# Altium project ComboCamera_OV2640.PrjPcb
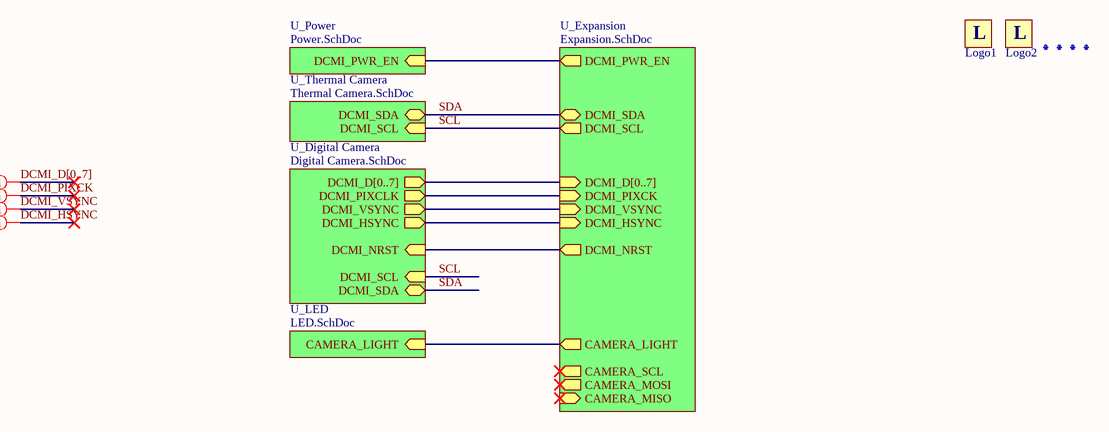
[diagram p0: ComboCamera_OV2640.SchDoc]
6 sheets, 63 parts. Net scope: hierarchical (ports join the sheet entries above them; power ports are global).
Board file: ComboCamera_OV2640.PcbDoc
Sheets:
  ComboCamera_OV2640.SchDoc
    U_Power = Power.SchDoc
    U_Digital Camera = Digital Camera.SchDoc
    U_Thermal Camera = Thermal Camera.SchDoc
    U_Expansion = Expansion.SchDoc
    U_LED = LED.SchDoc

## Sheet ComboCamera_OV2640.SchDoc: Combo Camera
size A4; Revision: 1; SheetNumber: 1; SheetTotal: 1; SheetSize: A4

### Parts
Fid1  Fiducial mark  [Fiducial]  (value not drawn)  (no BOM)
Fid2  Fiducial mark  [Fiducial]  (value not drawn)  (no BOM)
Fid3  Fiducial mark  [Fiducial]  (value not drawn)  (no BOM)
Fid4  Fiducial mark  [Fiducial]  (value not drawn)  (no BOM)
Logo1  Logo symbol  [LOGO_YILDIZIOT]  (value not drawn)  (no BOM)
Logo2  Logo symbol  [LOGO_YILDIZIOT]  (value not drawn)  (no BOM)

### Sub-sheets
U_Digital Camera = Digital Camera.SchDoc: DCMI_D[0..7] (out), DCMI_PIXCLK (out), DCMI_VSYNC (out), DCMI_HSYNC (out), DCMI_SCL (in), DCMI_SDA (bidir), DCMI_NRST (in)
U_Expansion = Expansion.SchDoc: DCMI_D[0..7] (in), DCMI_PWR_EN (out), DCMI_VSYNC (in), DCMI_HSYNC (in), DCMI_PIXCK (in), DCMI_SDA (bidir), DCMI_SCL (out), CAMERA_SCL (out), CAMERA_MISO (in), CAMERA_MOSI (out), CAMERA_LIGHT (out), DCMI_NRST (out)
U_LED = LED.SchDoc: CAMERA_LIGHT (in)
U_Power = Power.SchDoc: DCMI_PWR_EN (in)
U_Thermal Camera = Thermal Camera.SchDoc: DCMI_SDA (bidir), DCMI_SCL (in)

### Nets
CAMERA_LIGHT: sheet U_Expansion/CAMERA_LIGHT, sheet U_LED/CAMERA_LIGHT
DCMI_HSYNC: sheet U_Digital Camera/DCMI_HSYNC, sheet U_Expansion/DCMI_HSYNC
DCMI_NRST: sheet U_Digital Camera/DCMI_NRST, sheet U_Expansion/DCMI_NRST
DCMI_PIXCK: sheet U_Digital Camera/DCMI_PIXCLK, sheet U_Expansion/DCMI_PIXCK
DCMI_PWREN: sheet U_Power/DCMI_PWR_EN, sheet U_Expansion/DCMI_PWR_EN
DCMI_VSYNC: sheet U_Digital Camera/DCMI_VSYNC, sheet U_Expansion/DCMI_VSYNC
SCL: sheet U_Digital Camera/DCMI_SCL, sheet U_Thermal Camera/DCMI_SCL, sheet U_Expansion/DCMI_SCL  [project net DCMI_SCL]
SDA: sheet U_Digital Camera/DCMI_SDA, sheet U_Thermal Camera/DCMI_SDA, sheet U_Expansion/DCMI_SDA  [project net DCMI_SDA]

### Buses and harness runs
bus DCMI_D[0..7]
bus sheet U_Digital Camera/DCMI_D[0..7] = sheet U_Expansion/DCMI_D[0..7]

### Layout directives
rule Matched Net Lengths [Tolerance = 100mil]; net class DCMI: (no net found under the mark), DCMI_HSYNC, DCMI_PIXCK, DCMI_VSYNC

### Notes on the sheet
- Title:
- Size:
- Project:
- Revision:
- Sheet
- of
- Date:
- YıLDıZ IoT
- Elperek Mahallesi
- Saray Sokak, No:12
- SAKARYA / TURKEY
- File:
- (in symbol Logo) L

### Library data of the parts
Fid1-Fid4 = Fiducial: Part Number: Fid-Mark; Artikkelnr Noca: N.A.; Manufacturer: *; Manufacturer Part Number: *; Datasheet: *; LatestRevisionDate: 2009-12-12; Pin Count: 1; Publisher: Nordic Semiconductor; Published: 2009-12-12; Value: *; Note: *; Supplier: *; Supplier part number: *; 2nd source Supplier: *; 2nd source part number: *; Footprint Doc: Fiducial; Artikkelnr Simpro: N.A.
Logo1 Logo2 = Logo: Schematic symbol for Logo

## Sheet Power.SchDoc: POWER
size A4; SheetSize: A4
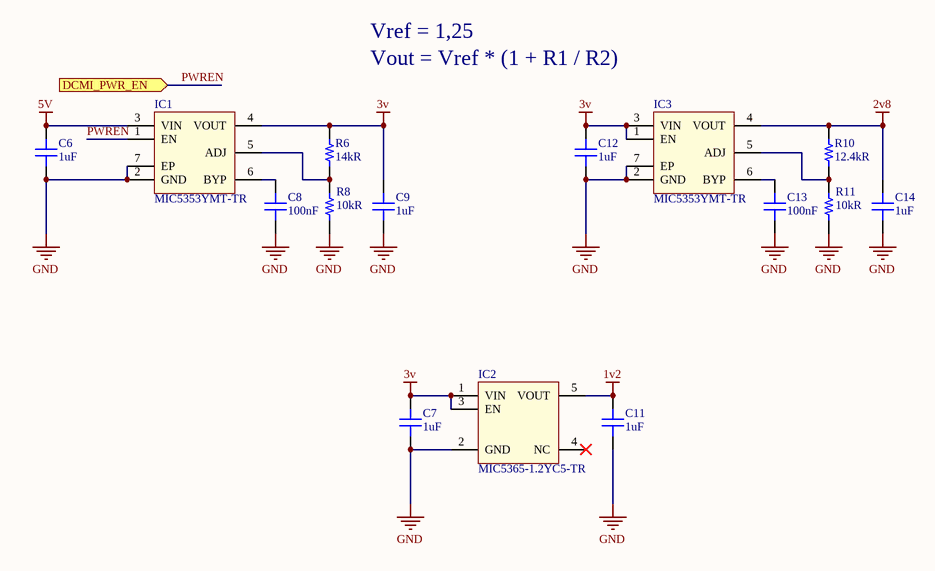
[diagram p1: Power.SchDoc]

### Parts
C6  1uF  [CAP 0603/1608]
C7  1uF  [CAP 0603/1608]
C8  100nF  [CAP 0603/1608]
C9  1uF  [CAP 0603/1608]
C11  1uF  [CAP 0603/1608]
C12  1uF  [CAP 0603/1608]
C13  100nF  [CAP 0603/1608]
C14  1uF  [CAP 0603/1608]
IC1  MIC5353YMT-TR  [MICREL MLF-6 1.6x1.6MM]
IC2  MIC5365-1.2YC5-TR  [MICROCHIP SC70-5 LT]
IC3  MIC5353YMT-TR  [MICREL MLF-6 1.6x1.6MM]
R6  14kR  [RES 0603/1608]
R8  10kR  [RES 0603/1608]
R10  12.4kR  [RES 0603/1608]
R11  10kR  [RES 0603/1608]

### Ports
DCMI_PWR_EN (in)

### Nets
1v2: C11.2 IC2.5(VOUT)
2v8: C14.2 IC3.4(VOUT) R10.2
3v: C7.2 C9.2 C12.2 IC1.4(VOUT) IC2.1(VIN) IC2.3(EN) IC3.1(EN) IC3.3(VIN) R6.2
5V: C6.2 IC1.3(VIN)
GND: C6.1 C7.1 C8.1 C9.1 C11.1 C12.1 C13.1 C14.1 IC1.2(GND) IC1.7(EP) IC2.2(GND) IC3.2(GND) IC3.7(EP) R8.2 R11.2
PWREN: IC1.1(EN) ; port DCMI_PWR_EN  [project net DCMI_PWREN]
NetC8_2: C8.2 IC1.6(BYP)
NetC13_2: C13.2 IC3.6(BYP)
NetIC1_5: IC1.5(ADJ) R6.1 R8.1
NetIC3_5: IC3.5(ADJ) R10.1 R11.1

Not connected (* = marked no-connect by the designer): IC2 4(NC)*

### Notes on the sheet
- Vout = Vref * (1 + R1 / R2)
- Vref = 1,25
- Title:
- Size:
- Project:
- Revision:
- Sheet
- of
- Date:
- YıLDıZ IoT
- Elperek Mahallesi
- Saray Sokak, No:12
- SAKARYA / TURKEY
- File:

### Library data of the parts
C6 C7 C9 C11 C12 C14 = Capacitor - Ceramic: Ceramic, SMT Capacitor; Manufacturer: Samsung; Manufacturer Part Number: CL10A105KP8NNNC; Tolerance: 10%; Voltage Rating: 10V; Dielectric: X5R; Supplier 1: Digi-Key; Supplier Part Number 1: 1276-1182-1-ND; Stock 1: 4590831; Pricing 1: 1 = 0,10000, 10 = 0,03800, 100 = 0,01680, 500 = 0,01200, 1000 = 0,00943 (USD); RoHS: Yes; Mount: Surface Mount; Case/Package: 0603; Case Code (Metric): 1608; Case Code (Imperial): 0603; Contact Plating: Tin; Min Operating Temperature: -55°C; Max Operating Temperature: 85°C; Packaging: Tape and Reel; Package Quantity: 1; Capacitance: 1uF; Voltage: 10V; Length: 1.6mm; Height: 0.8mm; Width: 0.031inch; Thickness: 0.035inch; Depth: 0.8mm; Radiation Hardening: No; ComponentLink1URL: https://datasheet.ciiva.com/15195/getdatasheetpartid-358616-15195708.pdf?src-supplier=Verical; ComponentLink1Description: https://datasheet.ciiva.com/15195/getdatasheetpartid-358616-15195708.pdf?src-supplier=Verical; ComponentLink2URL: https://datasheet.ciiva.com/16358/cl05b104kq5nnnc-16358431.pdf?src-supplier=Future+Electronics; ComponentLink2Description: https://datasheet.ciiva.com/16358/cl05b104kq5nnnc-16358431.pdf?src-supplier=Future+Electronics
C8 C13 = Capacitor - Ceramic: Ceramic, SMT Capacitor; Manufacturer: Samsung; Manufacturer Part Number: CL10B104JB8NNNC; Tolerance: 5%; Voltage Rating: 50V; Dielectric: X7R; Supplier 1: Digi-Key; Supplier Part Number 1: 1276-1033-1-ND; Stock 1: 223594; Pricing 1: 1 = 0,10000, 10 = 0,05300, 100 = 0,02350, 500 = 0,01680, 1000 = 0,01320 (USD); RoHS: Yes; Mount: Surface Mount; Case/Package: 0603; Case Code (Metric): 1608; Case Code (Imperial): 0603; Material: Ceramic; Contact Plating: Tin; Min Operating Temperature: -55°C; Max Operating Temperature: 125°C; Packaging: Tape and Reel; Package Quantity: 1; Capacitance: 100nF; Voltage: 50V; Length: 1.6mm; Height: 0.8mm; Width: 0.031inch; Thickness: 0.035inch; Depth: 0.8mm; Radiation Hardening: No; ComponentLink1URL: https://media.digikey.com/pdf/Data%20Sheets/Samsung%20PDFs/CL_Series_MLCC_ds.pdf?src-supplier=Digi-Key; ComponentLink1Description: https://media.digikey.com/pdf/Data%20Sheets/Samsung%20PDFs/CL_Series_MLCC_ds.pdf?src-supplier=Digi-Key; ComponentLink2URL: https://www.verical.com/server-webapp/html/getDatasheet?partID=359321&src-supplier=Verical; ComponentLink2Description: https://www.verical.com/server-webapp/html/getDatasheet?partID=359321&src-supplier=Verical; ComponentLink3URL: http://www1.futureelectronics.com/doc/SAMSUNG/CL10B104JB8NNNC.pdf?src-supplier=Future+Electronics; ComponentLink3Description: http://www1.futureelectronics.com/doc/SAMSUNG/CL10B104JB8NNNC.pdf?src-supplier=Future+Electronics; ComponentLink4URL: https://produktinfo.conrad.com/datenblaetter/450000-474999/456613-da-01-en-VS_KONDENSATOR_0603.pdf?src-supplier=Conrad; ComponentLink4Description: https://produktinfo.conrad.com/datenblaetter/450000-474999/456613-da-01-en-VS_KONDENSATOR_0603.pdf?src-supplier=Conrad
IC1 IC3 = MICROCHIP MIC5353: Integrated Circuit; ComponentLink1URL: http://www.farnell.com/datasheets/2245202.pdf?src-supplier=Farnell; ComponentLink1Description: http://www.farnell.com/datasheets/2245202.pdf?src-supplier=Farnell; ComponentLink2URL: http://www.microchip.com/mymicrochip/filehandler.aspx?ddocname=en579989&src-supplier=Digi-Key; ComponentLink2Description: http://www.microchip.com/mymicrochip/filehandler.aspx?ddocname=en579989&src-supplier=Digi-Key; ComponentLink3URL: http://www.farnell.com/datasheets/1692673.pdf?src-supplier=Element14; ComponentLink3Description: http://www.farnell.com/datasheets/1692673.pdf?src-supplier=Element14; Supplier 1: Digi-Key; Supplier Part Number 1: 576-3681-1-ND; Manufacturer: Microchip; Manufacturer Part Number: MIC5353YMT-TR; Stock 1: 1004; Pricing 1: 1 = 0,34000, 25 = 0,28000, 100 = 0,26000 (USD); RoHS: Yes; ComponentLink4URL: https://datasheet.ciiva.com/2049/mic5353-2049344.pdf?src-supplier=Digi-Key; ComponentLink4Description: https://datasheet.ciiva.com/2049/mic5353-2049344.pdf?src-supplier=Digi-Key; ComponentLink5URL: https://datasheet.ciiva.com/2049/mic5353-2049342.pdf?src-supplier=Digi-Key; ComponentLink5Description: https://datasheet.ciiva.com/2049/mic5353-2049342.pdf?src-supplier=Digi-Key; ComponentLink6URL: https://datasheet.ciiva.com/2049/mic5353-2049343.pdf?src-supplier=Digi-Key; ComponentLink6Description: https://datasheet.ciiva.com/2049/mic5353-2049343.pdf?src-supplier=Digi-Key
IC2 = MICROCHIP MIC5365/6-xxYC: High perfonmance 150mA LDO; Description: Linear Voltage Regulator IC Positive Fixed 1 Output 1.2V 150mA SC-70-5; Supplier 1: Digi-Key; Supplier Part Number 1: 576-3175-1-ND; Manufacturer: Microchip; Manufacturer Part Number: MIC5365-1.2YC5-TR; Stock 1: 6440; Pricing 1: 1 = 0,12000, 25 = 0,10000, 100 = 0,09000 (USD); RoHS: Yes; ComponentLink1URL: https://datasheet.ciiva.com/16461/mic5365-16461882.pdf?src-supplier=Future+Electronics; ComponentLink1Description: https://datasheet.ciiva.com/16461/mic5365-16461882.pdf?src-supplier=Future+Electronics
R6 = Resistor_Chip: Ceramic, SMT Capacitor; Manufacturer: Yageo; Manufacturer Part Number: RC0603FR-0714KL; Tolerance: 1%; Power Rating: 100mW; Voltage Rating: 75V; Temperature Coefficient: 100ppm/°C; Voltage Rating (DC): 50V; Supplier 1: Digi-Key; Supplier Part Number 1: 311-14.0KHRCT-ND; Stock 1: 622097; Pricing 1: 1 = 0,10000, 10 = 0,02300, 100 = 0,00940, 1000 = 0,00421, 2500 = 0,00366 (USD); RoHS: Yes; Case/Package: 0603; Weight: 7.1E-05oz; Case Code (Metric): 1608; Case Code (Imperial): 0603; Min Operating Temperature: -55°C; Max Operating Temperature: 155°C; Resistance: 14kR; Packaging: Tape and Reel; Package Quantity: 1; Max Power Dissipation: 100mW; Features: Moisture Resistant; Composition: Thick Film; Number of Terminations: 2; Termination: SMD/SMT; Military Standard: Not; Length: 1.6mm; Height: 0.022inch; Width: 0.031inch; Depth: 0.8mm; Lead Free: Lead Free; ComponentLink1URL: https://datasheet.ciiva.com/15189/getdatasheetpartid-325152-15189610.pdf?src-supplier=Verical; ComponentLink1Description: https://datasheet.ciiva.com/15189/getdatasheetpartid-325152-15189610.pdf?src-supplier=Verical; ComponentLink2URL: https://datasheet.ciiva.com/2455/pyu-r-int-thick-7-2455089.pdf?src-supplier=Digi-Key; ComponentLink2Description: https://datasheet.ciiva.com/2455/pyu-r-int-thick-7-2455089.pdf?src-supplier=Digi-Key; ComponentLink3URL: https://datasheet.ciiva.com/2455/pyu-r-int-thick-7-2455090.pdf?src-supplier=Digi-Key; ComponentLink3Description: https://datasheet.ciiva.com/2455/pyu-r-int-thick-7-2455090.pdf?src-supplier=Digi-Key; ComponentLink4URL: https://datasheet.ciiva.com/2455/pyu-r-int-thick-7-2455091.pdf?src-supplier=Digi-Key; ComponentLink4Description: https://datasheet.ciiva.com/2455/pyu-r-int-thick-7-2455091.pdf?src-supplier=Digi-Key
R8 R11 = Resistor_Chip: Ceramic, SMT Capacitor; Manufacturer: Stackpole Electronics; Manufacturer Part Number: RNCP0603FTD10K0; Tolerance: 1%; Max Power Dissipation: 125mW; Temperature Coefficient: 100ppm/°C; Supplier 1: Digi-Key; Supplier Part Number 1: RNCP0603FTD10K0CT-ND; Stock 1: 183083; Pricing 1: 1 = 0,10000, 10 = 0,06700, 100 = 0,02730, 1000 = 0,01224, 2500 = 0,01063 (USD); RoHS: Yes; Mount: Surface Mount; Case/Package: 0603; Case Code (Metric): 1608; Case Code (Imperial): 0603; Contact Plating: Matte,Tin; Min Operating Temperature: -55°C; Max Operating Temperature: 155°C; Packaging: Tape and Reel; Resistance: 10kR; Composition: Thin Film; Number of Terminations: 2; Features: Anti-Sulfur,Moisture Resistant; Length: 0.059inch; Height: 0.02inch; Width: 0.031inch; Radiation Hardening: No; Lead Free: Lead Free
R10 = Resistor_Chip: Ceramic, SMT Capacitor; Manufacturer: Yageo; Manufacturer Part Number: RC0603FR-0712K4L; Temperature Coefficient: 100ppm/°C; Tolerance: 1%; Voltage Rating (DC): 50V; Max Power Dissipation: 100mW; Working Voltage: 75V; ComponentLink1URL: https://datasheet.ciiva.com/15189/getdatasheetpartid-325152-15189610.pdf?src-supplier=Verical; ComponentLink1Description: https://datasheet.ciiva.com/15189/getdatasheetpartid-325152-15189610.pdf?src-supplier=Verical; ComponentLink2URL: https://datasheet.ciiva.com/2455/pyu-r-int-thick-7-2455089.pdf?src-supplier=Digi-Key; ComponentLink2Description: https://datasheet.ciiva.com/2455/pyu-r-int-thick-7-2455089.pdf?src-supplier=Digi-Key; ComponentLink3URL: https://datasheet.ciiva.com/2455/pyu-r-int-thick-7-2455090.pdf?src-supplier=Digi-Key; ComponentLink3Description: https://datasheet.ciiva.com/2455/pyu-r-int-thick-7-2455090.pdf?src-supplier=Digi-Key; ComponentLink4URL: https://datasheet.ciiva.com/2455/pyu-r-int-thick-7-2455091.pdf?src-supplier=Digi-Key; ComponentLink4Description: https://datasheet.ciiva.com/2455/pyu-r-int-thick-7-2455091.pdf?src-supplier=Digi-Key; ComponentLink5URL: https://datasheet.ciiva.com/2455/pyu-r-int-thick-7-2455035.pdf?src-supplier=Digi-Key; ComponentLink5Description: https://datasheet.ciiva.com/2455/pyu-r-int-thick-7-2455035.pdf?src-supplier=Digi-Key; ComponentLink6URL: https://datasheet.ciiva.com/2455/pyu-r-int-thick-7-2455036.pdf?src-supplier=Digi-Key; ComponentLink6Description: https://datasheet.ciiva.com/2455/pyu-r-int-thick-7-2455036.pdf?src-supplier=Digi-Key; ComponentLink7URL: https://datasheet.ciiva.com/2455/pyu-r-int-thick-7-2455037.pdf?src-supplier=Digi-Key; ComponentLink7Description: https://datasheet.ciiva.com/2455/pyu-r-int-thick-7-2455037.pdf?src-supplier=Digi-Key; ComponentLink8URL: https://datasheet.ciiva.com/15189/getdatasheetpartid-406810-15189757.pdf?src-supplier=Verical; ComponentLink8Description: https://datasheet.ciiva.com/15189/getdatasheetpartid-406810-15189757.pdf?src-supplier=Verical; Supplier 1: Digi-Key; Supplier Part Number 1: 311-12.4KHRCT-ND; Stock 1: 851439; Pricing 1: 1 = 0,10000, 10 = 0,02300, 100 = 0,00940, 1000 = 0,00421, 2500 = 0,00366 (USD); RoHS: Yes; Case/Package: 0603; Case Code (Metric): 1608; Case Code (Imperial): 0603; Min Operating Temperature: -55°C; Max Operating Temperature: 155°C; Composition: Thick Film; Packaging: Tape and Reel; Resistance: 12.4kR; Features: Moisture Resistant; Number of Terminations: 2; Termination: SMD/SMT; Military Standard: Not; Package Quantity: 1; Power Rating: 100mW; Voltage Rating: 50V; Length: 0.063inch; Height: 0.022inch; Width: 0.031inch; Depth: 0.8mm; Lead Free: Lead Free; ComponentLink9URL: https://datasheet.ciiva.com/2454/pyu-r-int-thick-7-2454069.pdf?src-supplier=Digi-Key; ComponentLink9Description: https://datasheet.ciiva.com/2454/pyu-r-int-thick-7-2454069.pdf?src-supplier=Digi-Key; ComponentLink10URL: https://datasheet.ciiva.com/2454/pyu-r-int-thick-7-2454070.pdf?src-supplier=Digi-Key; ComponentLink10Description: https://datasheet.ciiva.com/2454/pyu-r-int-thick-7-2454070.pdf?src-supplier=Digi-Key; ComponentLink11URL: https://datasheet.ciiva.com/2454/pyu-r-int-thick-7-2454071.pdf?src-supplier=Digi-Key; ComponentLink11Description: https://datasheet.ciiva.com/2454/pyu-r-int-thick-7-2454071.pdf?src-supplier=Digi-Key

## Sheet Digital Camera.SchDoc
size A4; SheetSize: A4 P
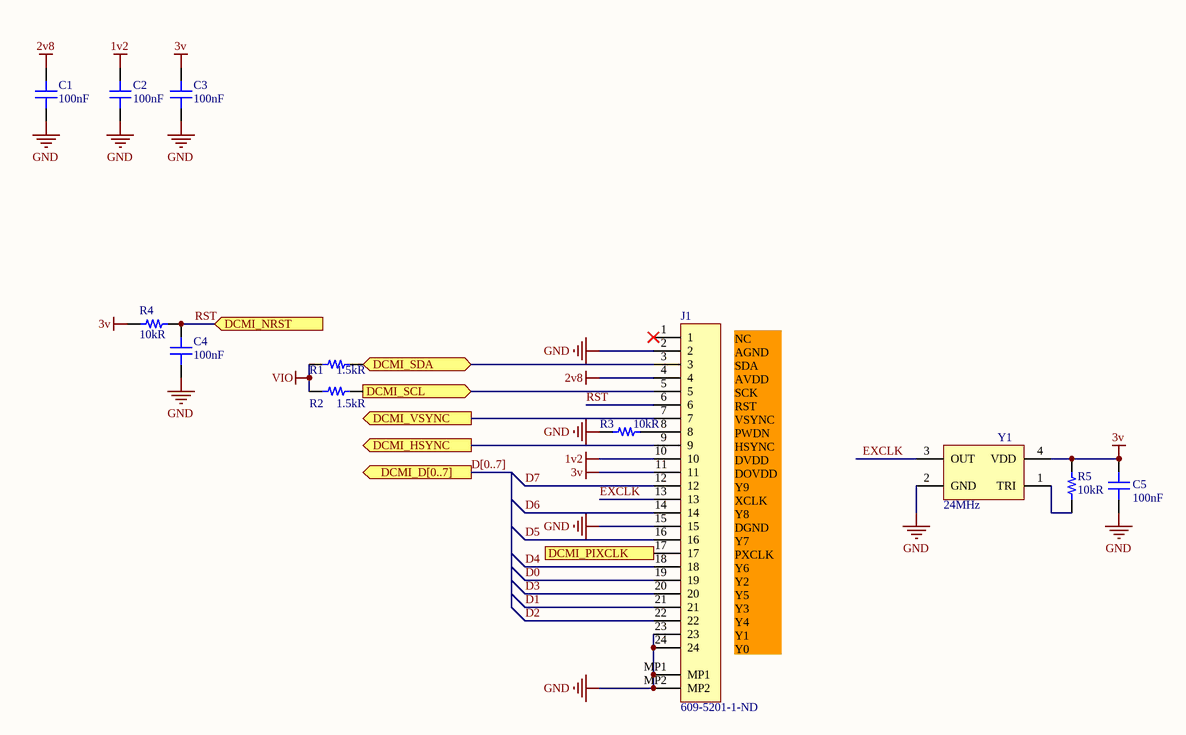
[diagram p2: Digital Camera.SchDoc]

### Parts
C1  100nF  [CAP 0603/1608]
C2  100nF  [CAP 0603/1608]
C3  100nF  [CAP 0603/1608]
C4  100nF  [CAP 0603/1608]
C5  100nF  [CAP 0603/1608]
J1  Supplier Part Number 1: 609-5201-1-ND  [Amphenol SFV24R-1STE1HLF]  (hidden comment: SFV24R-3STBE1HLF)
R1  1.5kR  [RES 0603/1608]
R2  1.5kR  [RES 0603/1608]
R3  10kR  [RES 0603/1608]
R4  10kR  [RES 0603/1608]
R5  10kR  [RES 0603/1608]
Y1  24MHz  [Abracon ASTX-11]

### Ports
DCMI_D[0..7] (out), DCMI_HSYNC (out), DCMI_NRST (in), DCMI_PIXCLK (out), DCMI_SCL (in), DCMI_SDA (bidir), DCMI_VSYNC (out)

### Nets
1v2: C2.2 J1.10
2v8: C1.2 J1.4
3v: C3.2 C5.2 J1.11 R4.2 R5.1 Y1.4(VDD)
GND: C1.1 C2.1 C3.1 C4.1 C5.1 J1.2 J1.15 J1.23 J1.24 J1.MP1 J1.MP2 R3.1 Y1.2(GND)
VIO: R1.2 R2.2
D0: J1.19
D1: J1.21
D2: J1.22
D3: J1.20
D4: J1.18
D5: J1.16
D6: J1.14
D7: J1.12
DCMI_HSYNC: J1.9 ; port DCMI_HSYNC
DCMI_PIXCK: J1.17 ; port DCMI_PIXCLK
DCMI_SCL: J1.5 R2.1 ; port DCMI_SCL
DCMI_SDA: J1.3 R1.1 ; port DCMI_SDA
DCMI_VSYNC: J1.7 ; port DCMI_VSYNC
EXCLK: J1.13 Y1.3(OUT)
RST: C4.2 J1.6 R4.1 ; port DCMI_NRST  [project net DCMI_NRST]
NetJ1_8: J1.8 R3.2
NetR5_2: R5.2 Y1.1(TRI)

Not connected (* = marked no-connect by the designer): J1 1*

### Buses and harness runs
bus D[0..7] = port DCMI_D[0..7]

### Notes on the sheet
- NC
  AGND
  SDA
  AVDD
  SCK
  RST
  VSYNC
  PWDN
  HSYNC
  DVDD
  DOVDD
  Y9
  XCLK
  Y8
  DGND
  Y7
  PXCLK
  Y6
  Y2
  Y5
  Y3
  Y4
  Y1
  Y0
- Title:
- Size:
- Project:
- Revision:
- Sheet
- of
- Date:
- YıLDıZ IoT
- Elperek Mahallesi
- Saray Sokak, No:12
- SAKARYA / TURKEY
- File:

### Library data of the parts
C1-C5 = Capacitor - Ceramic: as C8 on sheet Power; Supplier 1: Digi-Key; Supplier Part Number 1: 1276-1033-1-ND; Stock 1: 223594; Pricing 1: 1 = 0,10000, 10 = 0,05300, 100 = 0,02350, 500 = 0,01680, 1000 = 0,01320 (USD); RoHS: Yes; Mount: Surface Mount; Case/Package: 0603; Case Code (Metric): 1608; Case Code (Imperial): 0603; Material: Ceramic; Contact Plating: Tin; Min Operating Temperature: -55°C; Max Operating Temperature: 125°C; Packaging: Tape and Reel; Package Quantity: 1; Capacitance: 100nF; Voltage: 50V; Length: 1.6mm; Height: 0.8mm; Width: 0.031inch; Thickness: 0.035inch; Depth: 0.8mm; Radiation Hardening: No; ComponentLink1URL: https://media.digikey.com/pdf/Data%20Sheets/Samsung%20PDFs/CL_Series_MLCC_ds.pdf?src-supplier=Digi-Key; ComponentLink1Description: https://media.digikey.com/pdf/Data%20Sheets/Samsung%20PDFs/CL_Series_MLCC_ds.pdf?src-supplier=Digi-Key; ComponentLink2URL: https://www.verical.com/server-webapp/html/getDatasheet?partID=359321&src-supplier=Verical; ComponentLink2Description: https://www.verical.com/server-webapp/html/getDatasheet?partID=359321&src-supplier=Verical; ComponentLink3URL: http://www1.futureelectronics.com/doc/SAMSUNG/CL10B104JB8NNNC.pdf?src-supplier=Future+Electronics; ComponentLink3Description: http://www1.futureelectronics.com/doc/SAMSUNG/CL10B104JB8NNNC.pdf?src-supplier=Future+Electronics; ComponentLink4URL: https://produktinfo.conrad.com/datenblaetter/450000-474999/456613-da-01-en-VS_KONDENSATOR_0603.pdf?src-supplier=Conrad; ComponentLink4Description: https://produktinfo.conrad.com/datenblaetter/450000-474999/456613-da-01-en-VS_KONDENSATOR_0603.pdf?src-supplier=Conrad
J1 = FPC-24: Connector; Manufacturer: Amphenol FCI; Actuator Material: Glass,Polyphenylene; Voltage Rating: 50V; Current Rating: 500mA; Number of Positions: 24; Contact Location: Bottom; Insulation Resistance: 100MR; Pitch: 0.02inch; ComponentLink1URL: http://portal.fciconnect.com/Comergent//fci/drawing/10116954.pdf?src-supplier=Digi-Key; ComponentLink1Description: http://portal.fciconnect.com/Comergent//fci/drawing/10116954.pdf?src-supplier=Digi-Key; ComponentLink2URL: https://cdn.amphenol-icc.com/media/wysiwyg/files/drawing/10116954.pdf?src-supplier=Digi-Key; ComponentLink2Description: https://cdn.amphenol-icc.com/media/wysiwyg/files/drawing/10116954.pdf?src-supplier=Digi-Key; Supplier 1: Digi-Key; Manufacturer Part Number: SFV24R-3STBE1HLF; Stock 1: 4525; Pricing 1: 1 = 0,51000, 10 = 0,48200, 25 = 0,43400, 50 = 0,38580, 100 = 0,36960, 250 = 0,33748, 500 = 0,32142, 1000 = 0,26517 (USD); RoHS: Yes; Mount: Surface Mount; Contact Material: Bronze; Contact Plating: Gold; Housing Material: Polymer; Min Operating Temperature: -55°C; Max Operating Temperature: 105°C; Package Quantity: 6000; Packaging: Tape and Reel; Termination: Solder; Flammability Rating: UL94 V-0
R1 R2 = Resistor_Chip: Ceramic, SMT Capacitor; Manufacturer: Yageo; Manufacturer Part Number: RC0603FR-071K5L; Tolerance: 1%; Voltage Rating (DC): 50V; Temperature Coefficient: 100ppm/°C; Power Rating: 100mW; Supplier 1: Digi-Key; Supplier Part Number 1: 311-1.50KHRCT-ND; Stock 1: 4073514; Pricing 1: 1 = 0,10000, 10 = 0,02300, 100 = 0,00940, 1000 = 0,00421, 2500 = 0,00366 (USD); RoHS: Yes; Case/Package: 0603; Number of Pins: 2; Case Code (Metric): 1608; Case Code (Imperial): 0603; Min Operating Temperature: -55°C; Max Operating Temperature: 155°C; Packaging: Tape and Reel; Resistance: 1.5kR; Composition: Thick Film; Voltage Rating: 50V; Number of Terminations: 2; Termination: SMD/SMT; Military Standard: Not; Package Quantity: 1; Features: Moisture Resistant; Max Power Dissipation: 100mW; Length: 0.063inch; Height: 0.022inch; Width: 0.031inch; Depth: 0.8mm; REACH SVHC: No SVHC; Lead Free: Lead Free; ComponentLink1URL: https://datasheet.ciiva.com/2454/pyu-r-int-thick-7-2454513.pdf?src-supplier=Digi-Key; ComponentLink1Description: https://datasheet.ciiva.com/2454/pyu-r-int-thick-7-2454513.pdf?src-supplier=Digi-Key; ComponentLink2URL: https://datasheet.ciiva.com/2454/pyu-r-int-thick-7-2454514.pdf?src-supplier=Digi-Key; ComponentLink2Description: https://datasheet.ciiva.com/2454/pyu-r-int-thick-7-2454514.pdf?src-supplier=Digi-Key; ComponentLink3URL: https://datasheet.ciiva.com/2454/pyu-r-int-thick-7-2454515.pdf?src-supplier=Digi-Key; ComponentLink3Description: https://datasheet.ciiva.com/2454/pyu-r-int-thick-7-2454515.pdf?src-supplier=Digi-Key; ComponentLink4URL: https://datasheet.ciiva.com/46440/1868787-46440895.pdf?src-supplier=Element14; ComponentLink4Description: https://datasheet.ciiva.com/46440/1868787-46440895.pdf?src-supplier=Element14
R3-R5 = Resistor_Chip: as R8 on sheet Power; Supplier 1: Digi-Key; Supplier Part Number 1: RNCP0603FTD10K0CT-ND; Stock 1: 183083; Pricing 1: 1 = 0,10000, 10 = 0,06700, 100 = 0,02730, 1000 = 0,01224, 2500 = 0,01063 (USD); RoHS: Yes; Mount: Surface Mount; Case/Package: 0603; Case Code (Metric): 1608; Case Code (Imperial): 0603; Contact Plating: Matte,Tin; Min Operating Temperature: -55°C; Max Operating Temperature: 155°C; Packaging: Tape and Reel; Resistance: 10kR; Composition: Thin Film; Number of Terminations: 2; Features: Anti-Sulfur,Moisture Resistant; Length: 0.059inch; Height: 0.02inch; Width: 0.031inch; Radiation Hardening: No; Lead Free: Lead Free
Y1 = ASD1-1.544MHZ-EC-T: OSC XO 1.544MHZ CMOS SMD; Manufacturer: ECS Inc.; Manufacturer Part Number: ECS-3225MV-240-CN-TR; Base Resonator: Crystal; Function: Enable/Disable; Output: HCMOS; Voltage - Supply: 1.62V ~ 3.63V; Frequency Stability: ±25ppm; ComponentLink1Description: Datasheet; ComponentLink1URL: http://www.abracon.com/Oscillators/ASDseries.pdf; ComponentLink2Description: Digi-Key Listing; ComponentLink2URL: https://www.digikey.com/product-detail/en/ASD1-1.544MHZ-EC-T/535-9579-2-ND/1236896; Supplier 1: Digi-Key; Supplier Part Number 1: XC2884CT-ND; Stock 1: 1655; Pricing 1: 1 = 0,92000, 10 = 0,81700, 50 = 0,76380, 100 = 0,67510, 500 = 0,63954 (USD); RoHS: No; ComponentLink3URL: https://www.ecsxtal.com/store/pdf/ECS-3225MV.pdf?src-supplier=Digi-Key; ComponentLink3Description: https://www.ecsxtal.com/store/pdf/ECS-3225MV.pdf?src-supplier=Digi-Key; Packaging: Cut Tape (CT); Type: XO (Standard); Frequency: 24MHz; Series: ECS-3225MV

## Sheet Thermal Camera.SchDoc: Thermal
size A4; SheetSize: A4
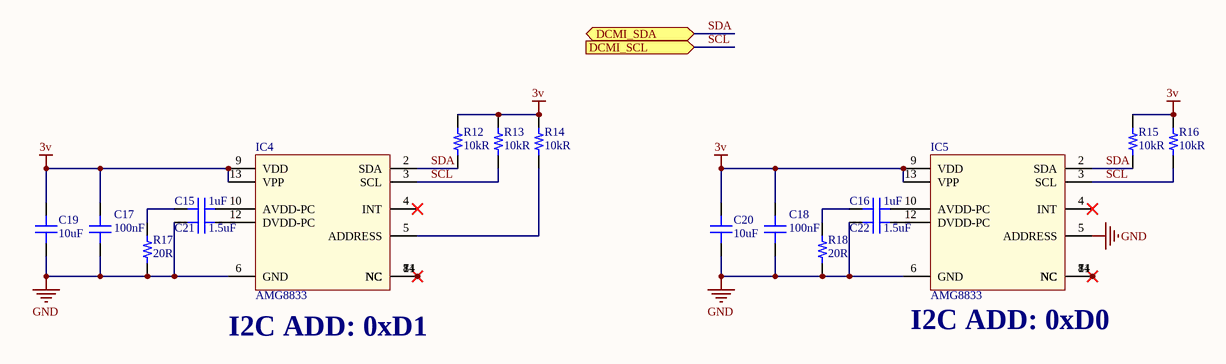
[diagram p3: Thermal Camera.SchDoc]

### Parts
C15  1uF  [CAP 0603/1608]
C16  1uF  [CAP 0603/1608]
C17  100nF  [CAP 0603/1608]
C18  100nF  [CAP 0603/1608]
C19  10uF  [CAP 0603/1608]
C20  10uF  [CAP 0603/1608]
C21  1.5uF  [CAP 0603/1608]
C22  1.5uF  [CAP 0603/1608]
IC4  AMG8833  [PANASONIC AMG8853]
IC5  AMG8833  [PANASONIC AMG8853]
R12  10kR  [RES 0603/1608]
R13  10kR  [RES 0603/1608]
R14  10kR  [RES 0603/1608]
R15  10kR  [RES 0603/1608]
R16  10kR  [RES 0603/1608]
R17  20R  [RES 0603/1608]
R18  20R  [RES 0603/1608]

### Ports
DCMI_SCL (in), DCMI_SDA (bidir)

### Nets
3v: C17.1 C18.1 C19.2 C20.2 IC4.9(VDD) IC4.13(VPP) IC5.9(VDD) IC5.13(VPP) R12.2 R13.2 R14.2 R15.2 R16.2
GND: C17.2 C18.2 C19.1 C20.1 C21.2 C22.2 IC4.6(GND) IC5.5(ADDRESS) IC5.6(GND) R17.1 R18.1
SCL: IC4.3(SCL) IC5.3(SCL) R13.1 R16.1 ; port DCMI_SCL  [project net DCMI_SCL]
SDA: IC4.2(SDA) IC5.2(SDA) R12.1 R15.1 ; port DCMI_SDA  [project net DCMI_SDA]
NetC15_1: C15.1 R17.2
NetC15_2: C15.2 IC4.10(AVDD-PC)
NetC16_1: C16.1 R18.2
NetC16_2: C16.2 IC5.10(AVDD-PC)
NetC21_1: C21.1 IC4.12(DVDD-PC)
NetC22_1: C22.1 IC5.12(DVDD-PC)
NetIC4_1: IC4.1(NC) IC4.7(NC) IC4.8(NC) IC4.11(NC) IC4.14(NC)
NetIC4_5: IC4.5(ADDRESS) R14.1
NetIC5_1: IC5.1(NC) IC5.7(NC) IC5.8(NC) IC5.11(NC) IC5.14(NC)

Not connected (* = marked no-connect by the designer): IC4 4(INT)*; IC5 4(INT)*

### Notes on the sheet
- (near IC4) I2C ADD: 0xD1
- (near IC5) I2C ADD: 0xD0
- Title:
- Size:
- Project:
- Revision:
- Sheet
- of
- Date:
- YıLDıZ IoT
- Elperek Mahallesi
- Saray Sokak, No:12
- SAKARYA / TURKEY
- File:

### Library data of the parts
C15 C16 = Capacitor - Ceramic: as C6 on sheet Power; Supplier 1: Digi-Key; Supplier Part Number 1: 1276-1182-1-ND; Stock 1: 4590831; Pricing 1: 1 = 0,10000, 10 = 0,03800, 100 = 0,01680, 500 = 0,01200, 1000 = 0,00943 (USD); RoHS: Yes; Mount: Surface Mount; Case/Package: 0603; Case Code (Metric): 1608; Case Code (Imperial): 0603; Contact Plating: Tin; Min Operating Temperature: -55°C; Max Operating Temperature: 85°C; Packaging: Tape and Reel; Package Quantity: 1; Capacitance: 1uF; Voltage: 10V; Length: 1.6mm; Height: 0.8mm; Width: 0.031inch; Thickness: 0.035inch; Depth: 0.8mm; Radiation Hardening: No; ComponentLink1URL: https://datasheet.ciiva.com/15195/getdatasheetpartid-358616-15195708.pdf?src-supplier=Verical; ComponentLink1Description: https://datasheet.ciiva.com/15195/getdatasheetpartid-358616-15195708.pdf?src-supplier=Verical; ComponentLink2URL: https://datasheet.ciiva.com/16358/cl05b104kq5nnnc-16358431.pdf?src-supplier=Future+Electronics; ComponentLink2Description: https://datasheet.ciiva.com/16358/cl05b104kq5nnnc-16358431.pdf?src-supplier=Future+Electronics
C17 C18 = Capacitor - Ceramic: as C8 on sheet Power; Supplier 1: Digi-Key; Supplier Part Number 1: 1276-1033-1-ND; Stock 1: 223594; Pricing 1: 1 = 0,10000, 10 = 0,05300, 100 = 0,02350, 500 = 0,01680, 1000 = 0,01320 (USD); RoHS: Yes; Mount: Surface Mount; Case/Package: 0603; Case Code (Metric): 1608; Case Code (Imperial): 0603; Material: Ceramic; Contact Plating: Tin; Min Operating Temperature: -55°C; Max Operating Temperature: 125°C; Packaging: Tape and Reel; Package Quantity: 1; Capacitance: 100nF; Voltage: 50V; Length: 1.6mm; Height: 0.8mm; Width: 0.031inch; Thickness: 0.035inch; Depth: 0.8mm; Radiation Hardening: No; ComponentLink1URL: https://media.digikey.com/pdf/Data%20Sheets/Samsung%20PDFs/CL_Series_MLCC_ds.pdf?src-supplier=Digi-Key; ComponentLink1Description: https://media.digikey.com/pdf/Data%20Sheets/Samsung%20PDFs/CL_Series_MLCC_ds.pdf?src-supplier=Digi-Key; ComponentLink2URL: https://www.verical.com/server-webapp/html/getDatasheet?partID=359321&src-supplier=Verical; ComponentLink2Description: https://www.verical.com/server-webapp/html/getDatasheet?partID=359321&src-supplier=Verical; ComponentLink3URL: http://www1.futureelectronics.com/doc/SAMSUNG/CL10B104JB8NNNC.pdf?src-supplier=Future+Electronics; ComponentLink3Description: http://www1.futureelectronics.com/doc/SAMSUNG/CL10B104JB8NNNC.pdf?src-supplier=Future+Electronics; ComponentLink4URL: https://produktinfo.conrad.com/datenblaetter/450000-474999/456613-da-01-en-VS_KONDENSATOR_0603.pdf?src-supplier=Conrad; ComponentLink4Description: https://produktinfo.conrad.com/datenblaetter/450000-474999/456613-da-01-en-VS_KONDENSATOR_0603.pdf?src-supplier=Conrad
C19 C20 = Capacitor - Ceramic: Ceramic, SMT Capacitor; Manufacturer: Samsung; Manufacturer Part Number: CL10A106MQ8NNNC; Tolerance: 20%; Voltage Rating: 6.3V; Dielectric: X5R; Supplier 1: Digi-Key; Supplier Part Number 1: 1276-1119-1-ND; Stock 1: 4408315; Pricing 1: 1 = 0,15000, 10 = 0,11000, 100 = 0,05150, 500 = 0,03614, 1000 = 0,02992 (USD); RoHS: Yes; Mount: Surface Mount; Case/Package: 0603; Case Code (Metric): 1608; Case Code (Imperial): 0603; Contact Plating: Tin; Min Operating Temperature: -55°C; Max Operating Temperature: 85°C; Package Quantity: 1; Packaging: Tape and Reel; Capacitance: 10uF; Voltage: 6.3V; Length: 1.6mm; Height: 0.8mm; Width: 0.031inch; Thickness: 0.035inch; Depth: 0.8mm; Radiation Hardening: No; ComponentLink1URL: https://datasheet.ciiva.com/25798/cl10a106mq8nnnc-25798320.pdf?src-supplier=Digi-Key; ComponentLink1Description: https://datasheet.ciiva.com/25798/cl10a106mq8nnnc-25798320.pdf?src-supplier=Digi-Key; ComponentLink2URL: https://datasheet.ciiva.com/26838/getdatasheetpartid-357557-26838347.pdf?src-supplier=Verical; ComponentLink2Description: https://datasheet.ciiva.com/26838/getdatasheetpartid-357557-26838347.pdf?src-supplier=Verical; ComponentLink3URL: https://datasheet.ciiva.com/16437/cl05b104kq5nnnc-16437327.pdf?src-supplier=Future+Electronics; ComponentLink3Description: https://datasheet.ciiva.com/16437/cl05b104kq5nnnc-16437327.pdf?src-supplier=Future+Electronics
C21 C22 = Capacitor - Ceramic: Ceramic, SMT Capacitor; Manufacturer: TDK; Manufacturer Part Number: C1608X7S1C155K080AC; Tolerance: 10%; Voltage Rating: 16V; ComponentLink1URL: https://datasheet.ciiva.com/15195/getdatasheetpartid-358616-15195708.pdf?src-supplier=Verical; ComponentLink1Description: https://datasheet.ciiva.com/15195/getdatasheetpartid-358616-15195708.pdf?src-supplier=Verical; ComponentLink2URL: https://datasheet.ciiva.com/16358/cl05b104kq5nnnc-16358431.pdf?src-supplier=Future+Electronics; ComponentLink2Description: https://datasheet.ciiva.com/16358/cl05b104kq5nnnc-16358431.pdf?src-supplier=Future+Electronics; Supplier 1: Digi-Key; Supplier Part Number 1: 445-174769-1-ND; Stock 1: 2796; Pricing 1: 1 = 0,23000, 10 = 0,15900, 100 = 0,09030, 500 = 0,06376, 1000 = 0,05579 (USD); RoHS: No; Mount: Surface Mount; Case/Package: 0603; Case Code (Imperial): 0603; Case Code (Metric): 1608; Min Operating Temperature: -55°C; Max Operating Temperature: 125°C; Packaging: Tape and Reel; Capacitance: 1.5uF; ComponentLink3URL: https://product.tdk.com/info/en/catalog/spec/mlccspec_commercial_general_midvoltage_en.pdf?src-supplier=Digi-Key; ComponentLink3Description: https://product.tdk.com/info/en/catalog/spec/mlccspec_commercial_general_midvoltage_en.pdf?src-supplier=Digi-Key; ComponentLink4URL: https://product.tdk.com/info/en/catalog/datasheets/mlcc_commercial_general_en.pdf?src-supplier=Digi-Key; ComponentLink4Description: https://product.tdk.com/info/en/catalog/datasheets/mlcc_commercial_general_en.pdf?src-supplier=Digi-Key
IC4 IC5 = Panasonic AMG8833: The Panasonic Electric Works' Grid Eye is a thermopile-type infrared sensor with digital communication. Using advanced MEMS technology, the Grid Eye monitors the quantity of infrared rays for 64 pixels of data. This page describes the internal memory structure that can be accessed through an I2C interface.; Sensing Method: Infrared (IR); Supplier 1: Digi-Key; Supplier Part Number 1: P19002CT-ND; Manufacturer: Panasonic; Manufacturer Part Number: AMG8833; Stock 1: 207; Pricing 1: 1 = 32,50000, 5 = 31,02400, 10 = 28,06900, 25 = 25,85280, 50 = 22,89820 (USD); RoHS: Yes; Case/Package: SMD/SMT; Min Operating Temperature: 0°C; Max Operating Temperature: 80°C; Packaging: Tape and Reel; Output Type: I2C; ComponentLink1URL: https://media.digikey.com/pdf/Data%20Sheets/Panasonic%20Sensors%20PDFs/Grid-EYE_AMG88.pdf?src-supplier=Digi-Key; ComponentLink1Description: https://media.digikey.com/pdf/Data%20Sheets/Panasonic%20Sensors%20PDFs/Grid-EYE_AMG88.pdf?src-supplier=Digi-Key; ComponentLink2URL: http://industrial.panasonic.com/cdbs/www-data/pdf/ADI8000/ADI8000C66.pdf?src-supplier=Newark; ComponentLink2Description: http://industrial.panasonic.com/cdbs/www-data/pdf/ADI8000/ADI8000C66.pdf?src-supplier=Newark; ComponentLink3URL: http://industrial.panasonic.com/cdbs/www-data/pdf/ADI8000/ADI8000C66.pdf?src-supplier=Farnell; ComponentLink3Description: http://industrial.panasonic.com/cdbs/www-data/pdf/ADI8000/ADI8000C66.pdf?src-supplier=Farnell
R12-R16 = Resistor_Chip: as R8 on sheet Power; Supplier 1: Digi-Key; Supplier Part Number 1: RNCP0603FTD10K0CT-ND; Stock 1: 183083; Pricing 1: 1 = 0,10000, 10 = 0,06700, 100 = 0,02730, 1000 = 0,01224, 2500 = 0,01063 (USD); RoHS: Yes; Mount: Surface Mount; Case/Package: 0603; Case Code (Metric): 1608; Case Code (Imperial): 0603; Contact Plating: Matte,Tin; Min Operating Temperature: -55°C; Max Operating Temperature: 155°C; Packaging: Tape and Reel; Resistance: 10kR; Composition: Thin Film; Number of Terminations: 2; Features: Anti-Sulfur,Moisture Resistant; Length: 0.059inch; Height: 0.02inch; Width: 0.031inch; Radiation Hardening: No; Lead Free: Lead Free
R17 R18 = Resistor_Chip: Ceramic, SMT Capacitor; Manufacturer: Yageo; Manufacturer Part Number: RC0603JR-0720RL; Voltage Rating (DC): 50V; Temperature Coefficient: 100ppm/°C; Tolerance: 5%; Max Power Dissipation: 100mW; Voltage Rating: 75V; Supplier 1: Digi-Key; Supplier Part Number 1: 311-20GRCT-ND; Stock 1: 99734; Pricing 1: 1 = 0,10000, 10 = 0,01900, 100 = 0,00770, 1000 = 0,00347, 2500 = 0,00301 (USD); RoHS: Yes; Case/Package: 0603; Weight: 7.1E-05oz; Case Code (Imperial): 0603; Case Code (Metric): 1608; Min Operating Temperature: -55°C; Max Operating Temperature: 155°C; Composition: Thick Film; Resistance: 20R; Packaging: Tape and Reel; Termination: SMD/SMT; Number of Terminations: 2; Military Standard: Not; Features: Moisture Resistant; Power Rating: 100mW; Package Quantity: 1; Length: 1.6mm; Height: 0.022inch; Width: 0.8mm; Depth: 0.8mm; Lead Free: Lead Free; REACH SVHC: Unknown; ComponentLink1URL: https://datasheet.ciiva.com/2453/pyu-r-int-thick-7-2453211.pdf?src-supplier=Digi-Key; ComponentLink1Description: https://datasheet.ciiva.com/2453/pyu-r-int-thick-7-2453211.pdf?src-supplier=Digi-Key; ComponentLink2URL: https://datasheet.ciiva.com/2453/pyu-r-int-thick-7-2453212.pdf?src-supplier=Digi-Key; ComponentLink2Description: https://datasheet.ciiva.com/2453/pyu-r-int-thick-7-2453212.pdf?src-supplier=Digi-Key; ComponentLink3URL: https://datasheet.ciiva.com/2453/pyu-r-int-thick-7-2453213.pdf?src-supplier=Digi-Key; ComponentLink3Description: https://datasheet.ciiva.com/2453/pyu-r-int-thick-7-2453213.pdf?src-supplier=Digi-Key

## Sheet Expansion.SchDoc
size A4; SheetSize: A4
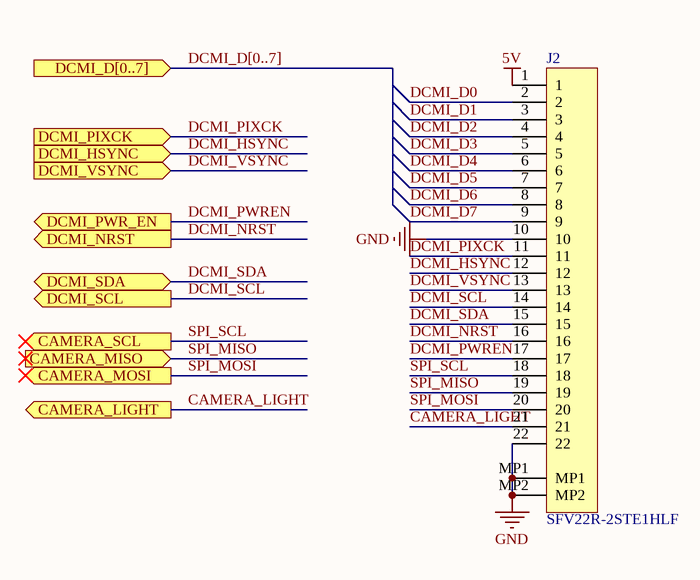
[diagram p4: Expansion.SchDoc]

### Parts
J2  SFV22R-2STE1HLF  [fpc-22]

### Ports
CAMERA_LIGHT (out), CAMERA_MISO (in), CAMERA_MOSI (out), CAMERA_SCL (out), DCMI_D[0..7] (in), DCMI_HSYNC (in), DCMI_NRST (out), DCMI_PIXCK (in), DCMI_PWR_EN (out), DCMI_SCL (out), DCMI_SDA (bidir), DCMI_VSYNC (in)

### Nets
5V: J2.1
GND: J2.10 J2.22 J2.MP1 J2.MP2
CAMERA_LIGHT: J2.21 ; port CAMERA_LIGHT
DCMI_D0: J2.2  [project net D0]
DCMI_D1: J2.3  [project net D1]
DCMI_D2: J2.4  [project net D2]
DCMI_D3: J2.5  [project net D3]
DCMI_D4: J2.6  [project net D4]
DCMI_D5: J2.7  [project net D5]
DCMI_D6: J2.8  [project net D6]
DCMI_D7: J2.9  [project net D7]
DCMI_HSYNC: J2.12 ; port DCMI_HSYNC
DCMI_NRST: J2.16 ; port DCMI_NRST
DCMI_PIXCK: J2.11 ; port DCMI_PIXCK
DCMI_PWREN: J2.17 ; port DCMI_PWR_EN
DCMI_SCL: J2.14 ; port DCMI_SCL
DCMI_SDA: J2.15 ; port DCMI_SDA
DCMI_VSYNC: J2.13 ; port DCMI_VSYNC
SPI_MISO: J2.19 ; port CAMERA_MISO
SPI_MOSI: J2.20 ; port CAMERA_MOSI
SPI_SCL: J2.18 ; port CAMERA_SCL

### Buses and harness runs
bus DCMI_D[0..7] = port DCMI_D[0..7]

### Notes on the sheet
- Title:
- Size:
- Project:
- Revision:
- Sheet
- of
- Date:
- YıLDıZ IoT
- Elperek Mahallesi
- Saray Sokak, No:12
- SAKARYA / TURKEY
- File:

### Library data of the parts
J2 = FPC-22: Connector; Manufacturer: Amphenol FCI; Actuator Material: Glass,Polyphenylene; Current Rating: 500mA; Voltage Rating: 50V; Contact Resistance: 30mR; Number of Positions: 22; Contact Location: Top; Insulation Resistance: 100MR; Wire/Cable Type: Straight; Pitch: 0.5mm; Supplier 1: Digi-Key; Supplier Part Number 1: 609-4319-1-ND; Manufacturer Part Number: SFV22R-2STE1HLF; Stock 1: 2152; Pricing 1: 1 = 0,79000, 10 = 0,74300, 25 = 0,66840, 50 = 0,59420, 100 = 0,56950, 250 = 0,52000, 500 = 0,49522, 1000 = 0,40856 (USD); RoHS: Yes; Mount: Surface Mount; Housing Color: Black; Contact Material: Bronze; Contact Plating: Tin; Housing Material: Polymer; Min Operating Temperature: -55°C; Max Operating Temperature: 105°C; Number of Rows: 1; Package Quantity: 3000; Packaging: Tape and Reel; Max Current Rating: 500mA; Termination: Solder; Number of Contacts: 22; Max Voltage Rating (AC): 50V; Orientation: Right Angle; Length: 16.5mm; Depth: 4.9mm; Radiation Hardening: No; Flammability Rating: UL94 V-0; ComponentLink1URL: https://datasheet.ciiva.com/670/10112793-670003.pdf?src-supplier=Digi-Key; ComponentLink1Description: https://datasheet.ciiva.com/670/10112793-670003.pdf?src-supplier=Digi-Key; ComponentLink2URL: https://datasheet.ciiva.com/670/10112793-670004.pdf?src-supplier=Digi-Key; ComponentLink2Description: https://datasheet.ciiva.com/670/10112793-670004.pdf?src-supplier=Digi-Key; ComponentLink3URL: https://datasheet.ciiva.com/13704/10112793-13704492.pdf?src-supplier=Mouser; ComponentLink3Description: https://datasheet.ciiva.com/13704/10112793-13704492.pdf?src-supplier=Mouser; ComponentLink4URL: https://datasheet.ciiva.com/670/10112793-670005.pdf?src-supplier=Digi-Key; ComponentLink4Description: https://datasheet.ciiva.com/670/10112793-670005.pdf?src-supplier=Digi-Key; ComponentLink5URL: https://datasheet.ciiva.com/10368/10112793-10368190.pdf?src-supplier=Avnet; ComponentLink5Description: https://datasheet.ciiva.com/10368/10112793-10368190.pdf?src-supplier=Avnet

## Sheet LED.SchDoc: FLASH LIGHT
size A4; SheetSize: A4
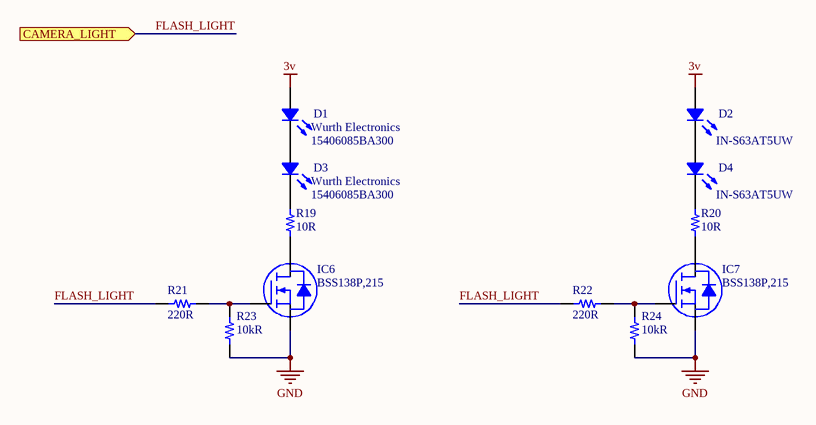
[diagram p5: LED.SchDoc]

### Parts
D1  15406085BA300  Manufacturer: Wurth Electronics  [LED 0603/1608]
D2  IN-S63AT5UW  [LED 0603/1608]
D3  15406085BA300  Manufacturer: Wurth Electronics  [LED 0603/1608]
D4  IN-S63AT5UW  [LED 0603/1608]
IC6  BSS138P,215  [DIODES SOT-23-3]
IC7  BSS138P,215  [DIODES SOT-23-3]
R19  10R  [RES 0603/1608]
R20  10R  [RES 0603/1608]
R21  220R  [RES 0603/1608]
R22  220R  [RES 0603/1608]
R23  10kR  [RES 0603/1608]
R24  10kR  [RES 0603/1608]

### Ports
CAMERA_LIGHT (in)

### Nets
3v: D1.1 D2.1
GND: IC6.2(S) IC7.2(S) R23.2 R24.2
FLASH_LIGHT: R21.1 R22.1 ; port CAMERA_LIGHT  [project net CAMERA_LIGHT]
NetD1_2: D1.2 D3.1
NetD2_2: D2.2 D4.1
NetD3_2: D3.2 R19.2
NetD4_2: D4.2 R20.2
NetIC6_1: IC6.1(G) R21.2 R23.1
NetIC6_3: IC6.3(D) R19.1
NetIC7_1: IC7.1(G) R22.2 R24.1
NetIC7_3: IC7.3(D) R20.1

### Notes on the sheet
- Title:
- Size:
- Project:
- Revision:
- Sheet
- of
- Date:
- YıLDıZ IoT
- Elperek Mahallesi
- Saray Sokak, No:12
- SAKARYA / TURKEY
- File:

### Library data of the parts
D1 D3 = LED: Chip LED; Supplier 1: Digi-Key; Supplier Part Number 1: 732-12005-1-ND; Manufacturer Part Number: 15406085BA300; Stock 1: 3808; Pricing 1: 1 = 0,60000, 10 = 0,54200, 100 = 0,50400, 500 = 0,46600, 1000 = 0,42800 (USD); RoHS: No; ComponentLink1URL: http://katalog.we-online.de/pbs/datasheet/15406085BA300.pdf?src-supplier=Digi-Key; ComponentLink1Description: http://katalog.we-online.de/pbs/datasheet/15406085BA300.pdf?src-supplier=Digi-Key
D2 D4 = LED: Chip LED; Manufacturer: Inolux; Color: White; Lens Color: Clear; Lens Style: Flat; Luminous Intensity: 900mcd; Forward Voltage: 3V; Test Current: 5mA; Viewing Angle: 120°; Lens Size: 0.8mm; ComponentLink1URL: http://katalog.we-online.de/pbs/datasheet/15406085BA300.pdf?src-supplier=Digi-Key; ComponentLink1Description: http://katalog.we-online.de/pbs/datasheet/15406085BA300.pdf?src-supplier=Digi-Key; Supplier 1: Digi-Key; Supplier Part Number 1: 1830-1063-1-ND; Manufacturer Part Number: IN-S63AT5UW; Stock 1: 44672; Pricing 1: 1 = 0,33000, 10 = 0,24000, 100 = 0,11360, 500 = 0,07576, 1000 = 0,05934 (USD); RoHS: No; Mount: Surface Mount; Case/Package: 0603; Case Code (Imperial): 0603; Case Code (Metric): 1608; Packaging: Tape and Reel; Lens Transparency: Clear; Length: 1.6mm; Height: 0.4mm; Width: 0.8mm; ComponentLink2URL: http://www.inolux-corp.com/datasheet/SMDLED/Mono%20Color%20Top%20View/IN-S63AT%20Series_V1.1.pdf?src-supplier=Digi-Key; ComponentLink2Description: http://www.inolux-corp.com/datasheet/SMDLED/Mono%20Color%20Top%20View/IN-S63AT%20Series_V1.1.pdf?src-supplier=Digi-Key
IC6 IC7 = BSS138-7-F: MOSFET N-CH 50V 200MA SOT23-3; Manufacturer: Nexperia; ComponentLink1Description: Datasheet; ComponentLink1URL: https://www.diodes.com/assets/Datasheets/ds30144.pdf; ComponentLink2Description: DigiKey Link; ComponentLink2URL: http://digikey.com/product-detail/en/diodes-incorporated/BSS138-7-F/BSS138-FDICT-ND/717843; Supplier 1: Digi-Key; Supplier Part Number 1: 1727-1142-1-ND; Manufacturer Part Number: BSS138P,215; Stock 1: 720934; Pricing 1: 1 = 0,16000, 10 = 0,14400, 25 = 0,13760, 100 = 0,06050, 250 = 0,05808, 500 = 0,04752, 1000 = 0,03300 (USD); RoHS: No; ComponentLink3URL: http://www.farnell.com/datasheets/923164.pdf?src-supplier=Farnell; ComponentLink3Description: http://www.farnell.com/datasheets/923164.pdf?src-supplier=Farnell; ComponentLink4URL: https://www.mouser.com/ds/2/302/BSS138P-114022.pdf?src-supplier=Mouser; ComponentLink4Description: https://www.mouser.com/ds/2/302/BSS138P-114022.pdf?src-supplier=Mouser; ComponentLink5URL: https://assets.nexperia.com/documents/data-sheet/BSS138P.pdf?src-supplier=Digi-Key; ComponentLink5Description: https://assets.nexperia.com/documents/data-sheet/BSS138P.pdf?src-supplier=Digi-Key; ComponentLink6URL: http://www.farnell.com/datasheets/923164.pdf?src-supplier=Newark; ComponentLink6Description: http://www.farnell.com/datasheets/923164.pdf?src-supplier=Newark
R19 R20 = Resistor_Chip: Ceramic, SMT Capacitor; Manufacturer: Yageo; Manufacturer Part Number: RC0603FR-0710RL; Tolerance: 1%; Voltage Rating (DC): 50V; Temperature Coefficient: 200ppm/°C; Power Rating: 100mW; Supplier 1: Digi-Key; Supplier Part Number 1: 311-10.0HRCT-ND; Stock 1: 10914948; Pricing 1: 1 = 0,10000, 10 = 0,04600, 100 = 0,01870, 1000 = 0,00840, 2500 = 0,00729 (USD); RoHS: Yes; Case/Package: 0603; Number of Pins: 2; Case Code (Imperial): 0603; Case Code (Metric): 1608; Contact Plating: Tin,Matte; Min Operating Temperature: -55°C; Max Operating Temperature: 155°C; Packaging: Tape and Reel; Resistance: 10R; Composition: Thick Film; Voltage Rating: 50V; Termination: SMD/SMT; Military Standard: Not; Length: 1.6mm; Height: 0.45mm; Width: 0.8mm; Depth: 0.8mm; Radiation Hardening: No; Lead Free: Lead Free; REACH SVHC: No SVHC; ComponentLink1URL: https://datasheet.ciiva.com/11808/0900766b80f96399-11808140.pdf?src-supplier=RSComponents; ComponentLink1Description: https://datasheet.ciiva.com/11808/0900766b80f96399-11808140.pdf?src-supplier=RSComponents; ComponentLink2URL: https://datasheet.ciiva.com/7746/443971-7746245.pdf?src-supplier=Element14; ComponentLink2Description: https://datasheet.ciiva.com/7746/443971-7746245.pdf?src-supplier=Element14; ComponentLink3URL: https://datasheet.ciiva.com/28386/pyu-rc0603-51-rohs-l-4-28386637.pdf?src-supplier=Avnet+Europe; ComponentLink3Description: https://datasheet.ciiva.com/28386/pyu-rc0603-51-rohs-l-4-28386637.pdf?src-supplier=Avnet+Europe; ComponentLink4URL: https://datasheet.ciiva.com/8891/pyu-rc0603-51-rohs-l-4-8891285.pdf?src-supplier=Avnet; ComponentLink4Description: https://datasheet.ciiva.com/8891/pyu-rc0603-51-rohs-l-4-8891285.pdf?src-supplier=Avnet
R21 R22 = Resistor_Chip: Ceramic, SMT Capacitor; Manufacturer: Yageo; Manufacturer Part Number: RC0603FR-07220RL; Tolerance: 1%; Voltage Rating (DC): 50V; Temperature Coefficient: 100ppm/°C; Power Rating: 100mW; Supplier 1: Digi-Key; Supplier Part Number 1: 311-220HRCT-ND; Stock 1: 5261609; Pricing 1: 1 = 0,10000, 10 = 0,02300, 100 = 0,00940, 1000 = 0,00421, 2500 = 0,00366 (USD); RoHS: Yes; Case/Package: 0603; Number of Pins: 2; Case Code (Imperial): 0603; Case Code (Metric): 1608; Min Operating Temperature: -55°C; Max Operating Temperature: 155°C; Resistance: 220R; Packaging: Tape and Reel; Composition: Thick Film; Voltage Rating: 50V; Package Quantity: 1; Features: Moisture Resistant; Max Power Dissipation: 100mW; Termination: SMD/SMT; Number of Terminations: 2; Military Standard: Not; Length: 1.6mm; Height: 0.022inch; Width: 0.031inch; Depth: 0.8mm; Lead Free: Lead Free; REACH SVHC: No SVHC; ComponentLink1URL: https://datasheet.ciiva.com/2453/pyu-r-int-thick-7-2453973.pdf?src-supplier=Digi-Key; ComponentLink1Description: https://datasheet.ciiva.com/2453/pyu-r-int-thick-7-2453973.pdf?src-supplier=Digi-Key; ComponentLink2URL: https://datasheet.ciiva.com/2453/pyu-r-int-thick-7-2453974.pdf?src-supplier=Digi-Key; ComponentLink2Description: https://datasheet.ciiva.com/2453/pyu-r-int-thick-7-2453974.pdf?src-supplier=Digi-Key; ComponentLink3URL: https://datasheet.ciiva.com/2453/pyu-r-int-thick-7-2453975.pdf?src-supplier=Digi-Key; ComponentLink3Description: https://datasheet.ciiva.com/2453/pyu-r-int-thick-7-2453975.pdf?src-supplier=Digi-Key; ComponentLink4URL: https://datasheet.ciiva.com/7746/1738695-7746300.pdf?src-supplier=Element14; ComponentLink4Description: https://datasheet.ciiva.com/7746/1738695-7746300.pdf?src-supplier=Element14; ComponentLink5URL: https://datasheet.ciiva.com/7746/1738695-7746301.pdf?src-supplier=Element14; ComponentLink5Description: https://datasheet.ciiva.com/7746/1738695-7746301.pdf?src-supplier=Element14
R23 R24 = Resistor_Chip: as R8 on sheet Power; Supplier 1: Digi-Key; Supplier Part Number 1: RNCP0603FTD10K0CT-ND; Stock 1: 183083; Pricing 1: 1 = 0,10000, 10 = 0,06700, 100 = 0,02730, 1000 = 0,01224, 2500 = 0,01063 (USD); RoHS: Yes; Mount: Surface Mount; Case/Package: 0603; Case Code (Metric): 1608; Case Code (Imperial): 0603; Contact Plating: Matte,Tin; Min Operating Temperature: -55°C; Max Operating Temperature: 155°C; Packaging: Tape and Reel; Resistance: 10kR; Composition: Thin Film; Number of Terminations: 2; Features: Anti-Sulfur,Moisture Resistant; Length: 0.059inch; Height: 0.02inch; Width: 0.031inch; Radiation Hardening: No; Lead Free: Lead Free

## Nets that join several sheets
1v2: Power (C11.2 IC2.5), Digital Camera (C2.2 J1.10)
2v8: Power (C14.2 IC3.4 R10.2), Digital Camera (C1.2 J1.4)
3v: Power (9 pins), Digital Camera (6 pins), Thermal Camera (13 pins), LED (D1.1 D2.1)
5V: Power (C6.2 IC1.3), Expansion (J2.1)
GND: Power (15 pins), Digital Camera (13 pins), Thermal Camera (11 pins), Expansion (J2.10 J2.22 J2.MP1 J2.MP2), LED (IC6.2 IC7.2 R23.2 R24.2)
CAMERA_LIGHT: Expansion (J2.21), LED (R21.1 R22.1)
D0: Digital Camera (J1.19), Expansion (J2.2)
D1: Digital Camera (J1.21), Expansion (J2.3)
D2: Digital Camera (J1.22), Expansion (J2.4)
D3: Digital Camera (J1.20), Expansion (J2.5)
D4: Digital Camera (J1.18), Expansion (J2.6)
D5: Digital Camera (J1.16), Expansion (J2.7)
D6: Digital Camera (J1.14), Expansion (J2.8)
D7: Digital Camera (J1.12), Expansion (J2.9)
DCMI_HSYNC: Digital Camera (J1.9), Expansion (J2.12)
DCMI_NRST: Digital Camera (C4.2 J1.6 R4.1), Expansion (J2.16)
DCMI_PIXCK: Digital Camera (J1.17), Expansion (J2.11)
DCMI_PWREN: Power (IC1.1), Expansion (J2.17)
DCMI_SCL: Digital Camera (J1.5 R2.1), Thermal Camera (IC4.3 IC5.3 R13.1 R16.1), Expansion (J2.14)
DCMI_SDA: Digital Camera (J1.3 R1.1), Thermal Camera (IC4.2 IC5.2 R12.1 R15.1), Expansion (J2.15)
DCMI_VSYNC: Digital Camera (J1.7), Expansion (J2.13)